# EasyEDA Pro project motor_driver.eprj

# Schematic Schematic1

## Sheets
1 P1: Create Date: 2024-08-04; Page Name: P1; Project Name: motor_driver; Schematic Name: Schematic1; Update Date: 2024-08-04; Company: 嘉立创EDA; Page Size: A4; Version: V1.0
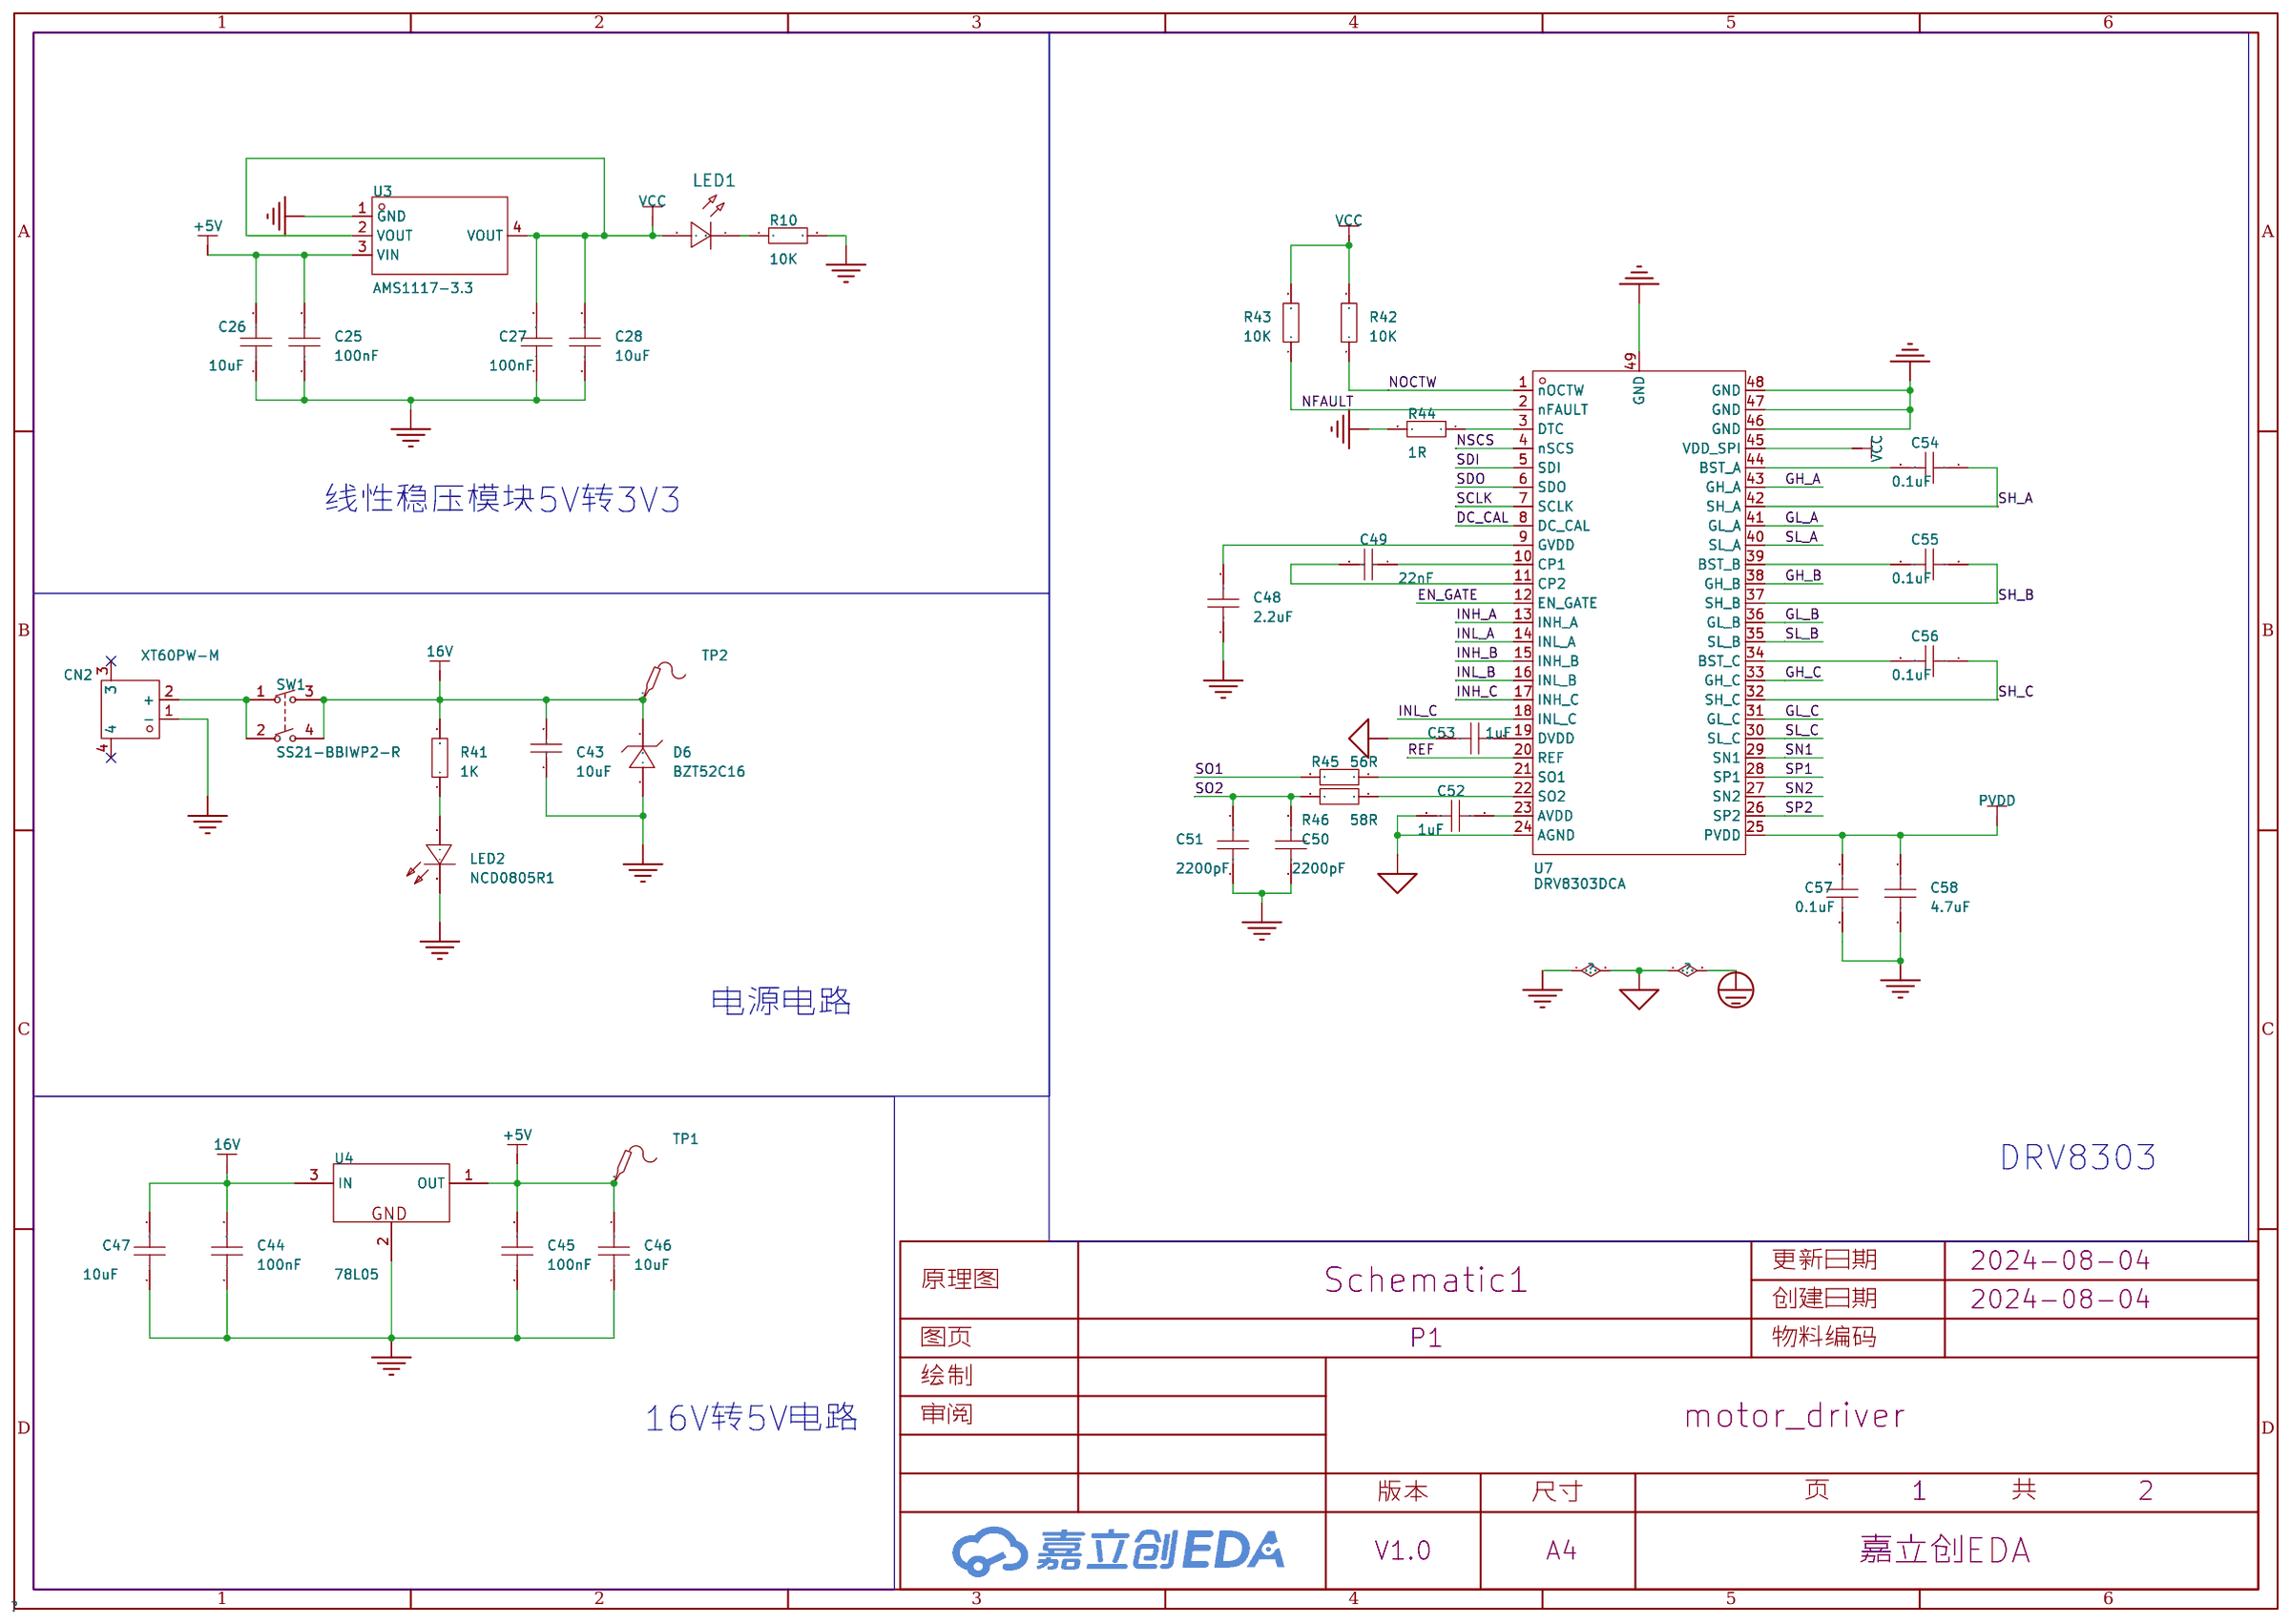
[diagram p0: P1]
2 P2: Page Name: P2
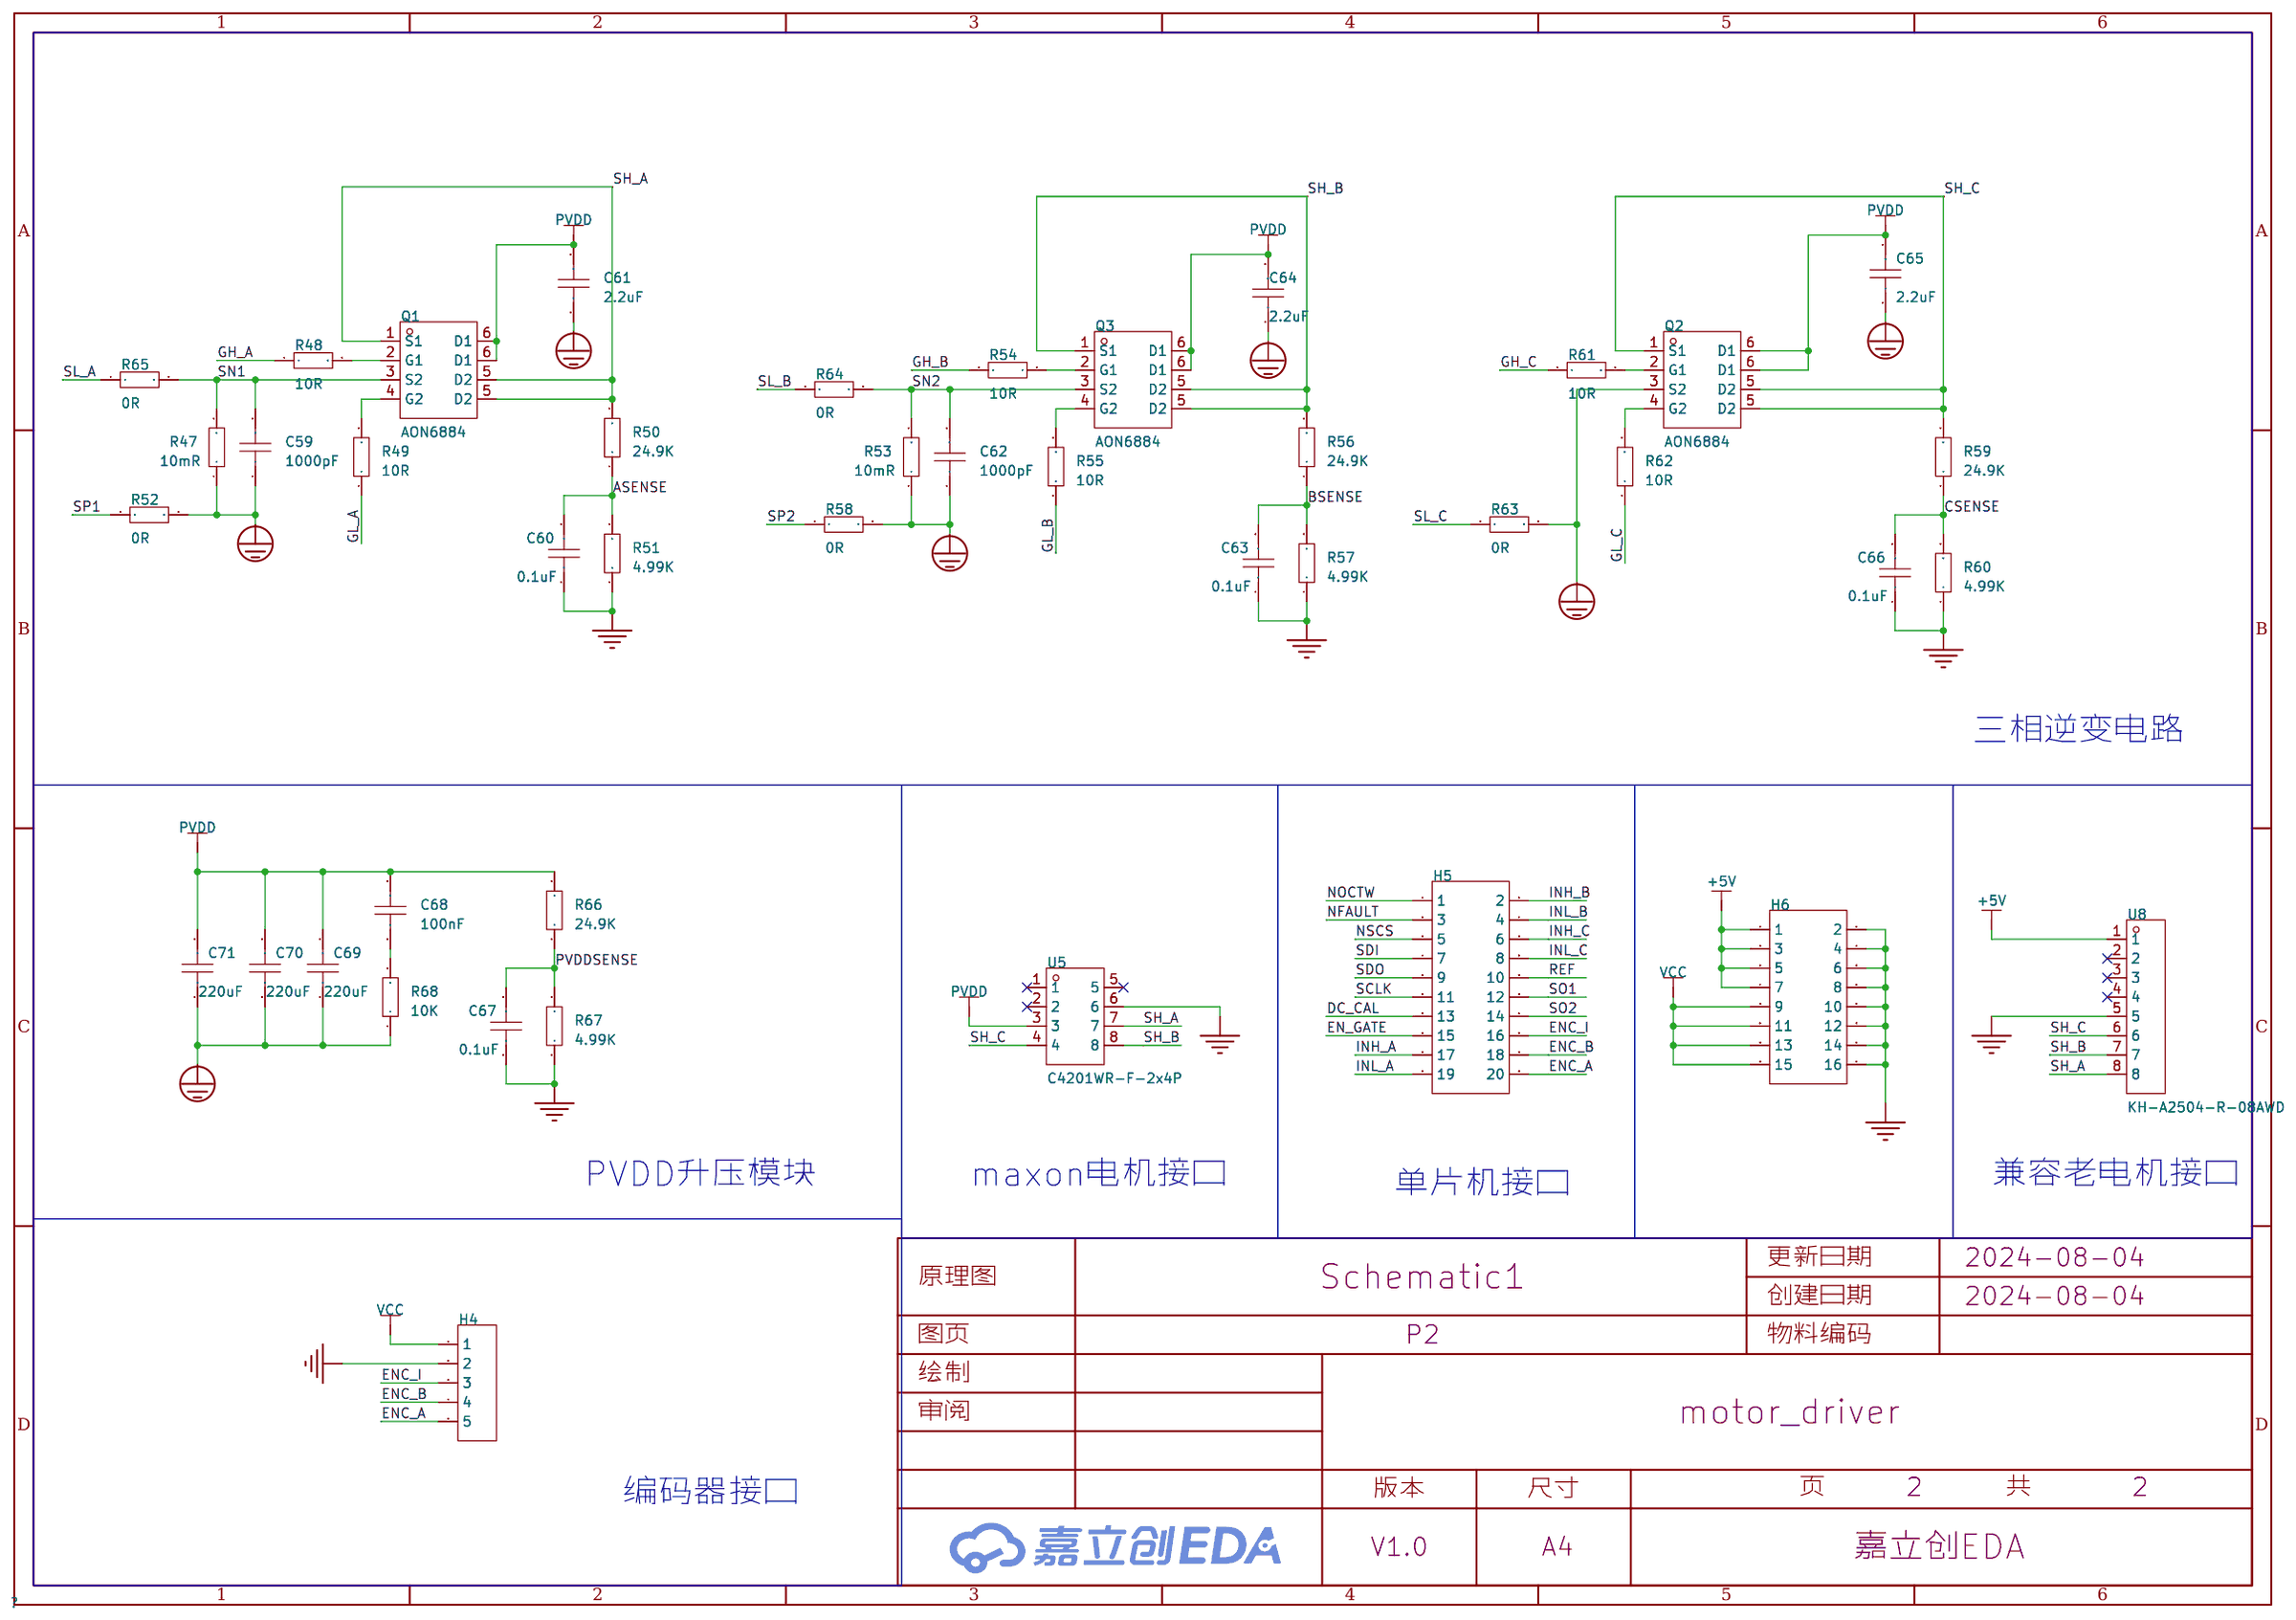
[diagram p1: P2]

## Parts
sheet P1
C25  100nF  [C0805]
C26  10uF  [C0805]
C27  100nF  [C0805]
C28  10uF  [C0805]
C43  10uF  [C1206]
C44  100nF  [C0805]
C45  100nF  [C0805]
C46  10uF  [C0805]
C47  10uF  [C0805]
C48  2.2uF  [C0805]
C49  22nF  [C0603]
C50  2200pF  [C0805]
C51  2200pF  [C0805]
C52  1uF  [C0805]
C53  1uF  [C0805]
C54  0.1uF  [C0805]
C55  0.1uF  [C0805]
C56  0.1uF  [C0805]
C57  0.1uF  [C0805]
C58  4.7uF  [C0805]
CN2  XT60PW-M  [CONN-TH_XT60PW-M]
D6  BZT52C16  [SOD-123_L2.7-W1.6-LS3.7-RD]
LED1  -  [LED_0805]
LED2  NCD0805R1  [LED0805-R-RD]
R10  10K  [R0805]
R41  1K  [R0603]
R42  10K  [R0603]
R43  10K  [R0603]
R44  1R  [R0603]
R45  56R  [R0603]
R46  58R  [R0603]
SW1  SS21-BBIWP2-R  [SW-TH_SS21-BBIWP2]
TP1  -  [Test-Point-0.5mm]
TP2  -  [Test-Point-0.5mm]
U3  AMS1117-3.3  [SOT-223-3_L6.5-W3.4-P2.30-LS7.0-BR]
U4  78L05  [SOT-89-3_L4.5-W2.5-P1.50-LS4.2-BR]
U7  DRV8303DCA  [HTSSOP-48_L12.5-W6.1-P0.50-LS8.1-BL-EP4.4]
sheet P2
C59  1000pF  [C0805]
C60  0.1uF  [C0603]
C61  2.2uF  [C0805]
C62  1000pF  [C0805]
C63  0.1uF  [C0603]
C64  2.2uF  [C0805]
C65  2.2uF  [C0805]
C66  0.1uF  [C0603]
C67  0.1uF  [C0603]
C68  100nF  [C0805]
C69  220uF  [C0805]
C70  220uF  [C0805]
C71  220uF  [C0805]
H4  -  [HDR-TH_5P-P2.54-V-F]
H5  -  [HDR-TH_20P-P2.54-V-R2-C10-S2.54]
H6  -  [HDR-TH_16P-P2.54-V-F-R2-C8-S2.54-1]
Q1  AON6884  [DFN-8_L5.5-W5.2-P1.27-LS6.0-BL-EP2]
Q2  AON6884  [DFN-8_L5.5-W5.2-P1.27-LS6.0-BL-EP2]
Q3  AON6884  [DFN-8_L5.5-W5.2-P1.27-LS6.0-BL-EP2]
R47  10mR  [R0603]
R48  10R  [R0603]
R49  10R  [R0603]
R50  24.9K  [R0603]
R51  4.99K  [R0603]
R52  0R  [R0603]
R53  10mR  [R0603]
R54  10R  [R0603]
R55  10R  [R0603]
R56  24.9K  [R0603]
R57  4.99K  [R0603]
R58  0R  [R0603]
R59  24.9K  [R0603]
R60  4.99K  [R0603]
R61  10R  [R0603]
R62  10R  [R0603]
R63  0R  [R0603]
R64  0R  [R0603]
R65  0R  [R0603]
R66  24.9K  [R0603]
R67  4.99K  [R0603]
R68  10K  [R0603]
U5  C4201WR-F-2x4P  [CONN-TH_C4201WR-F-2X4P]
U8  KH-A2504-R-08AWD  [CONN-TH_8P-P2.50_KH-A2504-R-08AWD]

## Library data of the parts
C25-C28 C44-C48 C50-C59 C61 C62 C64 C65 C68-C71 = CAP_0805: Supplier Footprint: 0805
C43 = CL31A106KBHNNNE: 容值:10uF;精度:±10%;额定电压:50V;材质(温度系数):X5R;; LCSC Part Name: 10uF ±10% 50V; Supplier Part: C13585; Manufacturer: SAMSUNG(三星); Supplier Footprint: 1206; JLCPCB Part Class: 基础库; Datasheet: https://atta.szlcsc.com/upload/public/pdf/source/20160218/1457707763339.pdf; Supplier: LCSC; Tolerance: ±10%; Voltage Rated: 50V; Temperature Coefficient: X5R
C49 = CL10B223KB8NNNC: 容值:22nF;精度:±10%;额定电压:50V;材质(温度系数):X7R;; LCSC Part Name: 22nF ±10% 50V; Supplier Part: C21122; Manufacturer: SAMSUNG(三星); Supplier Footprint: 0603; JLCPCB Part Class: 基础库; Datasheet: https://atta.szlcsc.com/upload/public/pdf/source/20160218/1457707763339.pdf; Supplier: LCSC; Tolerance: ±10%; Voltage Rated: 50V; Temperature Coefficient: X7R
CN2 = XT60PW-M: 类别:-;类型1:-;; LCSC Part Name: AMASS(艾迈斯)航模插头xt60连接器150公母对接pw锂电池公头 板插卧式XT60PW-M; Supplier Part: C98732; Manufacturer: AMASS(艾迈斯); JLCPCB Part Class: 扩展库; Datasheet: https://atta.szlcsc.com/upload/public/pdf/source/20240118/44A3DCFF53BE25DC65378AFFB21277A4.pdf; Supplier: LCSC; Brand: 艾迈斯; Type: 卧式插头; Colour: 黄色; InterfaceType: 公头
D6 = BZT52C16_C216724: 二极管配置:独立式;稳压值(标称值):16V;稳压值(范围):15.3V~17.1V;功率:500mW;精度:±5%;; Supplier Part: C216724; Manufacturer: SHIKUES(时科); Supplier Footprint: SOD-123; JLCPCB Part Class: 扩展库; Datasheet: https://atta.szlcsc.com/upload/public/pdf/source/20180521/C216736_0F7817A5B0D519AB82EE72E876335F07.pdf; Supplier: LCSC; Diode Configuration: 独立式; Zener Voltage (Nom): 16V; Reverse Leakage Current (Ir): 100nA@12V; Zener Voltage (Range): 15.3V~17.1V; Power Dissipation: 500mW; Zener Impedance (Zzt): 40Ω; Tolerance: ±5%
LED1 = LED_0805-R: Supplier Footprint: 0805
LED2 = NCD0805R1: 灯头类型:-;发光颜色:红色;正向电压(VF):1.6V~2.6V;功率:65mW;正向电流:20mA;主波长:615nm~630nm;二极管配置:独立二极管;透镜颜色:无色透明透镜;色温:-;发光强度:67mcd~195mcd;发光角度:130°;载带方式:-;工作温度:-30℃~+85℃;; Supplier Part: C84256; Manufacturer: 国星光电; Supplier Footprint: 0805; JLCPCB Part Class: 基础库; Datasheet: https://atta.szlcsc.com/upload/public/pdf/source/20200820/C84256_F0A75A43B3EAD75808600A0514C76B99.pdf; Supplier: LCSC; Emitted Color: 红色; Forward Voltage (VF): 1.6V~2.6V; Power Dissipation: 65mW; Forward Current: 20mA; Dominant Wavelength: 615nm~630nm; Diode Configuration: 独立二极管; Lens Color: 无色透明透镜; Luminous Intensity: 67mcd~195mcd; Viewing Angle: 130°; Operating Temperature: -30℃~+85℃
R10 = Res_0805: Supplier Footprint: 0805
R41-R68 = Res_0603: Supplier Footprint: 0603
SW1 = SS21-BBIWP2-R: 带灯:-;引脚样式:焊片;额定电流:10A;额定电压(AC):250V;额定电压(DC):-;电路结构:双刀单掷;机械寿命:-;; LCSC Part Name: 跷板开关DPST 15x21mm; Supplier Part: C309182; Manufacturer: Legion(六钧); Supplier Footprint: 插件; JLCPCB Part Class: 扩展库; Datasheet: https://atta.szlcsc.com/upload/public/pdf/source/20190311/C309182_BE3155CDE2291F8D537E9264D9294CC5.pdf; Supplier: LCSC; Actuator Type: 凹面弯曲; Pin Style: 焊片; Actuator Color: 黑色; Contact Current: 10A; Voltage Rating (AC): 250V; Circuit: 双刀单掷; Actuator Identifier: - O
TP1 TP2 = Test-Point: Test Point 测试点
U3 = AMS1117-3.3_C6186: 输出类型:固定;最大输入电压:-;输出电压:3.3V;最大输出电流:1A;电源纹波抑制比(PSRR):72dB@(120Hz);输出极性:正极;; LCSC Part Name: 输出3.3V 1A; Supplier Part: C6186; Manufacturer: AMS; Supplier Footprint: SOT-223; JLCPCB Part Class: 基础库; Datasheet: https://atta.szlcsc.com/upload/public/pdf/source/20180727/C6186_7A095716F0823C02F1997A905E26C086.pdf; Supplier: LCSC; Output Type: 固定; Output Voltage: 3.3V; MAX Output Current: 1A; Power Supply Rejection Ratio (PSRR): 72dB@(120Hz); Dropout Voltage: 1.3V@(800mA); Output Polarity: 正极; Number of Outputs: 1
U4 = 78L05_C347258: 输出类型:固定;最大输入电压:30V;输出电压:5V;最大输出电流:100mA;电源纹波抑制比(PSRR):49dB@(120Hz);输出极性:正极;; LCSC Part Name: 输入30V 输出5V 100mA; Supplier Part: C347258; Manufacturer: UMW(友台半导体); Supplier Footprint: SOT-89-3; JLCPCB Part Class: 扩展库; Datasheet: https://atta.szlcsc.com/upload/public/pdf/source/20231109/E3DE607B64FB2BED1580456949804217.pdf; Supplier: LCSC; Output Type: 固定; Maximum Input Voltage: 30V; Output Voltage: 5V; MAX Output Current: 100mA; Power Supply Rejection Ratio (PSRR): 49dB@(120Hz); Dropout Voltage: 1.7V@(40mA); standby current: 5.5mA; Operating Temperature: -20℃~+120℃@(Tj); Output Polarity: 正极; Number of Outputs: 1
U7 = DRV8303DCA: DRV8303 具有电流分流放大器和 SPI 的最大 65V 三相栅极驱动器; LCSC Part Name: 无刷直流BLDC电机驱动芯片 60V; Supplier Part: C1523892; Manufacturer: TI(德州仪器); Supplier Footprint: HTSSOP-48-EP-6.1mm; JLCPCB Part Class: 扩展库; Datasheet: https://www.ti.com/cn/lit/gpn/drv8303; Supplier: LCSC
C60 C63 C66 C67 = CAP_0603: Supplier Footprint: 0603
H4 = HDR-F_2.54_1x5P: Supplier Part: C50950; Supplier Footprint: 插件
H5 = HDR-F_2.54_2x10: Supplier Part: C30867; Supplier Footprint: 插件
H6 = HDR-F_2.54_2x8: Supplier Part: C30734; Supplier Footprint: 插件
Q1-Q3 = AON6884: 类型:2个N沟道;漏源电压(Vdss):40V;连续漏极电流(Id):9A;功率(Pd):1.6W;导通电阻(RDS(on)@Vgs,Id):11.3mΩ@10V,10A;阈值电压(Vgs(th)@Id):2.7V@250uA;; LCSC Part Name: 2个N沟道 耐压:40V 电流:9A; Supplier Part: C125872; Manufacturer: AOS; Supplier Footprint: DFN-8(5.2x5.5); JLCPCB Part Class: 扩展库; Datasheet: https://atta.szlcsc.com/upload/public/pdf/source/20180326/C125872_34AF0DD57D8DED273B86A053347F87CE.pdf; Supplier: LCSC; Type: 2个N沟道; Drain Source Voltage (Vdss): 40V; Continuous Drain Current (Id): 9A; Power Dissipation (Pd): 1.6W; Drain Source On Resistance (RDS(on)@Vgs,Id): 11.3mΩ@10V,10A; Gate Threshold Voltage (Vgs(th)@Id): 2.7V@250uA
U5 = C4201WR-F-2x4P_C5333426: Supplier Part: C5333426; Manufacturer: CJT(长江连接器); Supplier Footprint: 弯插,P=4.2mm; JLCPCB Part Class: 扩展库; Datasheet: https://atta.szlcsc.com/upload/public/pdf/source/20210326/C2764355_A41BE8F3AF9C3DD861E3A84F228C93DC.pdf; Supplier: LCSC
U8 = KH-A2504-R-08AWD: 插针结构:1x8P;间距:2.54mm;安装方式:弯插;总PIN数:8P;排数:1;每排PIN数:8;; LCSC Part Name: 间距:2.54mm 1x8P 白色; Supplier Part: C18186422; Manufacturer: kinghelm(金航标); Supplier Footprint: 插件,P=2.5mm; JLCPCB Part Class: 扩展库; Datasheet: https://atta.szlcsc.com/upload/public/pdf/source/20230919/6D15C2409625FC46455D302EA5C53430.pdf; Supplier: LCSC; Pins Structure: 1x8P; Pitch: 2.54mm; Mounting Style: 弯插; Number of Pins: 8P; Number of Rows: 1; Number of PINs Per Row: 8

## Nets
16V: C43.2 C44.2 C47.2 D6.1(K) R41.2 SW1.3 SW1.4 TP2.1 U4.3(IN)
+5V: C25.2 C26.2 C45.2 C46.2 H6.1 H6.3 H6.5 H6.7 TP1.1 U3.3(VIN) U4.1(OUT) U8.1
AGND: C25.1 C26.1 C27.1 C28.1 C43.1 C44.1 C45.1 C46.1 C47.1 C48.1 C50.1 C51.1 C52.2 C53.2 C57.2 C58.2 C59.1 C60.1 C61.1 C62.1 C63.1 C64.1 C65.1 C66.1 C67.1 C69.1 C70.1 C71.1 CN2.1(-) D6.2(A) H4.2 H6.2 H6.4 H6.6 H6.8 H6.10 H6.12 H6.14 H6.16 LED2.2(-) Q2.3(S2) R10.2 R44.2 R47.1 R51.1 R52.2 R53.1 R57.1 R58.2 R60.1 R63.2 R67.1 R68.1 U3.1(GND) U4.2(GND) U5.6 U7.24(AGND) U7.46(GND) U7.47(GND) U7.48(GND) U7.49(GND) U8.5
PVDD: C57.1 C58.1 C61.2 C64.2 C65.2 C68.2 C69.2 C70.2 C71.2 Q1.6(D1) Q2.6(D1) Q3.6(D1) R66.2 U5.3 U7.25(PVDD)
PVDDSENSE: C67.2 R66.1 R67.2
VCC: C27.2 C28.2 H4.1 H6.9 H6.11 H6.13 H6.15 LED1.2(A) R42.2 R43.2 U3.2(VOUT) U3.4(VOUT) U7.45(VDD_SPI)
ASENSE: C60.2 R50.1 R51.2
BSENSE: C63.2 R56.1 R57.2
CSENSE: C66.2 R59.1 R60.2
DC_CAL: H5.13 U7.8(DC_CAL)
EN_GATE: H5.15 U7.12(EN_GATE)
ENC_A: H4.5 H5.20
ENC_B: H4.4 H5.18
ENC_I: H4.3 H5.16
GH_A: R48.1 U7.43(GH_A)
GH_B: R54.1 U7.38(GH_B)
GH_C: R61.1 U7.33(GH_C)
GL_A: R49.1 U7.41(GL_A)
GL_B: R55.1 U7.36(GL_B)
GL_C: R62.1 U7.31(GL_C)
INH_A: H5.17 U7.13(INH_A)
INH_B: H5.2 U7.15(INH_B)
INH_C: H5.6 U7.17(INH_C)
INL_A: H5.19 U7.14(INL_A)
INL_B: H5.4 U7.16(INL_B)
INL_C: H5.8 U7.18(INL_C)
NFAULT: H5.3 R43.1 U7.2(nFAULT)
NOCTW: H5.1 R42.1 U7.1(nOCTW)
NSCS: H5.5 U7.4(nSCS)
REF: H5.10 U7.20(REF)
SCLK: H5.11 U7.7(SCLK)
SDI: H5.7 U7.5(SDI)
SDO: H5.9 U7.6(SDO)
SH_A: C54.1 Q1.1(S1) Q1.5(D2) R50.2 U5.7 U7.42(SH_A) U8.8
SH_B: C55.1 Q3.1(S1) Q3.5(D2) R56.2 U5.8 U7.37(SH_B) U8.7
SH_C: C56.1 Q2.1(S1) Q2.5(D2) R59.2 U5.4 U7.32(SH_C) U8.6
SL_A: R65.1 U7.40(SL_A)
SL_B: R64.1 U7.35(SL_B)
SL_C: R63.1 U7.30(SL_C)
SN1: C59.2 Q1.3(S2) R47.2 R65.2 U7.29(SN1)
SN2: C62.2 Q3.3(S2) R53.2 R64.2 U7.27(SN2)
SO1: H5.12 R45.2
SO2: C50.2 C51.2 H5.14 R46.2
SP1: R52.1 U7.28(SP1)
SP2: R58.1 U7.26(SP2)
$3N286: LED1.1(C) R10.1
$3N603: CN2.2(+) SW1.1 SW1.2
$3N605: LED2.1(+) R41.1
$3N1469: R44.1 U7.3(DTC)
$3N1546: C48.2 U7.9(GVDD)
$3N1634: C49.1 U7.10(CP1)
$3N1637: C49.2 U7.11(CP2)
$3N1642: R45.1 U7.21(SO1)
$3N1645: R46.1 U7.22(SO2)
$3N1837: C52.1 U7.23(AVDD)
$3N1907: C53.1 U7.19(DVDD)
$3N2117: C54.2 U7.44(BST_A)
$3N2227: C56.2 U7.34(BST_C)
$3N2233: C55.2 U7.39(BST_B)
$4N615: Q1.2(G1) R48.2
$4N618: Q1.4(G2) R49.2
$4N1413: Q3.2(G1) R54.2
$4N1415: Q3.4(G2) R55.2
$4N1749: Q2.2(G1) R61.2
$4N1755: Q2.4(G2) R62.2
$4N2179: C68.1 R68.2

Not connected (* = marked no-connect by the designer): CN2 3* 4*; U5 1* 2* 5*; U8 2* 3* 4*

## Notes on the sheets
sheet 1
- 线性稳压模块5V转3V3
- 电源电路
- DRV8303
- 16V转5V电路
sheet 2
- 三相逆变电路
- PVDD升压模块
- maxon电机接口
- 单片机接口
- 兼容老电机接口
- 编码器接口

# Board PCB1
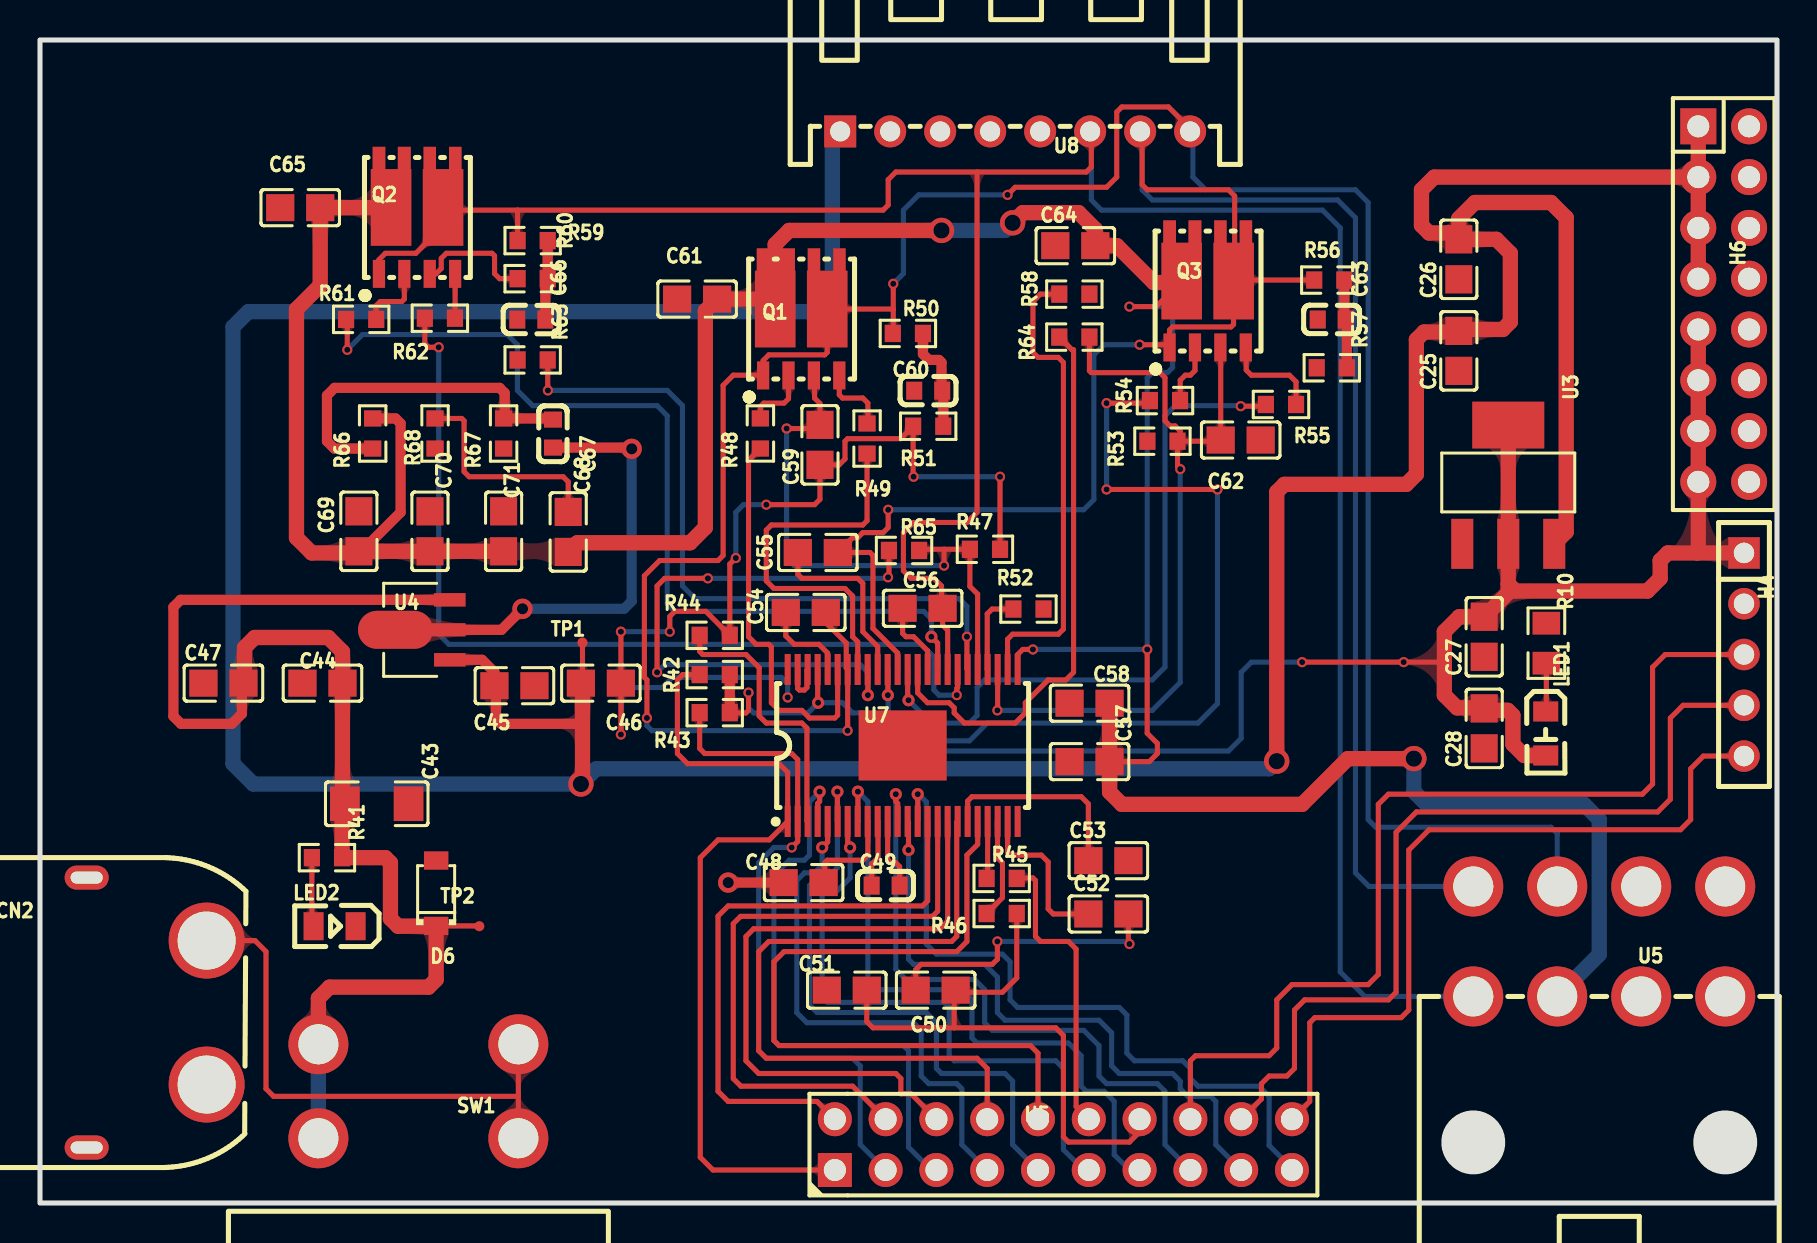
[diagram p2: board, top side]
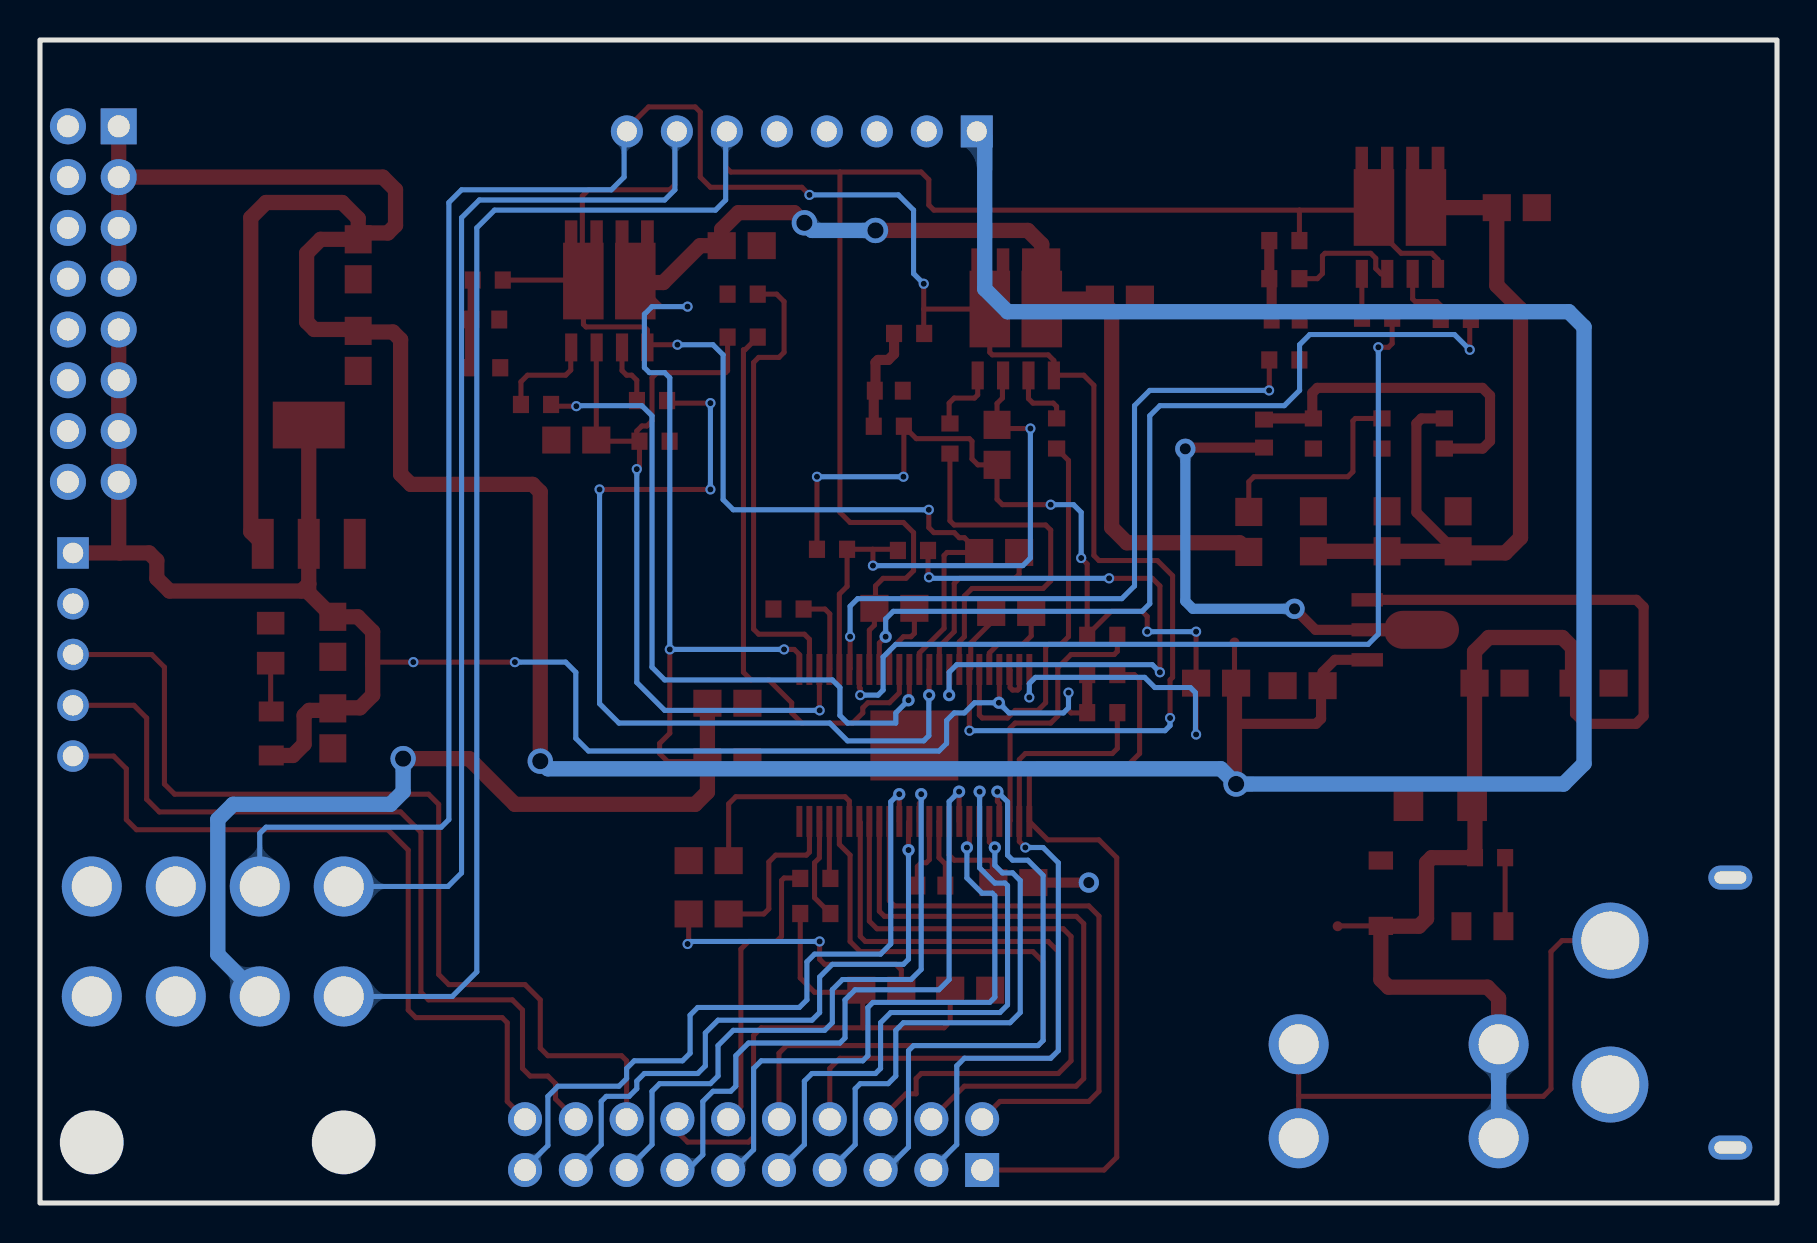
[diagram p3: board, bottom side, seen from below]

Outline 86.87 x 58.17 mm; copper layers: Top Layer, Bottom Layer. Coordinates in mm from the lower left corner of the outline.
Outline path: rectangle 0,58.17 86.87,0
Stack: Top Layer 0.035mm / Dielectric1 1.51mm FR4 er 4.5 / Bottom Layer 0.035mm

## Design rules (mm)
template: JLCPCB Capability(Two Layers Board)
spacing copperThickness1oz (default): track to track 0.102, other pairs 0.152 to 0.3
spacing copperThickness2oz: track to track 0.203, other pairs 0.152 to 0.3
track width copperThickness1oz (default): min 0.127, default 0.254, max 2.54
track width copperThickness2oz: min 0.203, default 0.254, max 2.54
differential pair differentialPair (default): width min 0.127, default 0.254, max 2.54; gap min 0.152, default 0.152
via viaSize (default): diameter min 0.5, default 0.61, max 10; hole min 0.3, default 0.305, max 6.3

## Placement (name value [footprint] x y rotation side)
C25  100nF  [C0805]  70.95 42.62 90 top
C26  10uF  [C0805]  70.95 47.2 90 top
C27  100nF  [C0805]  72.22 28.32 90 top
C28  10uF  [C0805]  72.22 23.74 90 top
C43  10uF  [C1206]  16.84 19.97 180 top
C44  100nF  [C0805]  14.13 26 0 top
C45  100nF  [C0805]  23.73 25.87 180 top
C46  10uF  [C0805]  28.05 26 180 top
C47  10uF  [C0805]  9.17 26 0 top
C48  2.2uF  [C0805]  38.19 16.03 0 top
C49  22nF  [C0603]  42.29 15.88 0 top
C50  2200pF  [C0805]  44.79 10.65 0 top
C51  2200pF  [C0805]  40.35 10.65 0 top
C52  1uF  [C0805]  53.43 14.46 0 top
C53  1uF  [C0805]  53.43 17.12 0 top
C54  0.1uF  [C0805]  38.3 29.53 180 top
C55  0.1uF  [C0805]  38.9 32.54 180 top
C56  0.1uF  [C0805]  44.14 29.74 180 top
C57  0.1uF  [C0805]  52.49 22.08 180 top
C58  4.7uF  [C0805]  52.49 25 180 top
C59  1000pF  [C0805]  39.01 37.92 90 top
C60  0.1uF  [C0603]  44.42 40.63 0 top
C61  2.2uF  [C0805]  32.86 45.21 0 top
C62  1000pF  [C0805]  60.05 38.16 180 top
C63  0.1uF  [C0603]  64.6 44.19 0 top
C64  2.2uF  [C0805]  51.78 47.88 0 top
C65  2.2uF  [C0805]  13.01 49.78 0 top
C66  0.1uF  [C0603]  24.57 44.18 0 top
C67  0.1uF  [C0603]  25.65 38.48 90 top
C68  100nF  [C0805]  26.42 33.56 270 top
C69  220uF  [C0805]  15.95 33.59 270 top
C70  220uF  [C0805]  19.5 33.59 270 top
C71  220uF  [C0805]  23.19 33.59 270 top
CN2  XT60PW-M  [CONN-TH_XT60PW-M]  5.33 9.53 0 top
D6  BZT52C16  [SOD-123_L2.7-W1.6-LS3.7-RD]  19.81 15.49 90 top
H4  -  [HDR-TH_5P-P2.54-V-F]  85.22 27.43 270 top
H5  -  [HDR-TH_20P-P2.54-V-R2-C10-S2.54]  51.18 2.92 0 top
H6  -  [HDR-TH_16P-P2.54-V-F-R2-C8-S2.54-1]  84.2 44.96 270 top
LED1  -  [LED_0805]  75.3 23.43 270 top
LED2  NCD0805R1  [LED0805-R-RD]  14.73 13.84 180 top
Q1  AON6884  [DFN-8_L5.5-W5.2-P1.27-LS6.0-BL-EP2]  38.07 43.05 0 top
Q2  AON6884  [DFN-8_L5.5-W5.2-P1.27-LS6.0-BL-EP2]  18.86 48.13 0 top
Q3  AON6884  [DFN-8_L5.5-W5.2-P1.27-LS6.0-BL-EP2]  58.4 44.45 0 top
R10  10K  [R0805]  75.33 28 90 top
R41  1K  [R0603]  14.35 17.27 0 top
R42  10K  [R0603]  33.74 26.43 0 top
R43  10K  [R0603]  33.74 24.52 0 top
R44  1R  [R0603]  33.74 28.39 0 top
R45  56R  [R0603]  48.09 16.23 0 top
R46  58R  [R0603]  48.09 14.48 0 top
R47  10mR  [R0603]  47.26 32.69 180 top
R48  10R  [R0603]  36.03 38.49 90 top
R49  10R  [R0603]  41.36 38.23 90 top
R50  24.9K  [R0603]  43.4 43.49 180 top
R51  4.99K  [R0603]  44.42 38.85 0 top
R52  0R  [R0603]  49.43 29.71 0 top
R53  10mR  [R0603]  56.13 38.1 0 top
R54  10R  [R0603]  56.26 40.13 0 top
R55  10R  [R0603]  62.06 39.94 0 top
R56  24.9K  [R0603]  64.48 46.16 180 top
R57  4.99K  [R0603]  64.6 41.77 0 top
R58  0R  [R0603]  51.73 45.46 0 top
R59  24.9K  [R0603]  24.64 48.13 180 top
R60  4.99K  [R0603]  24.64 46.23 0 top
R61  10R  [R0603]  16.06 44.19 0 top
R62  10R  [R0603]  20 44.25 0 top
R63  0R  [R0603]  24.64 42.16 180 top
R64  0R  [R0603]  51.73 43.31 0 top
R65  0R  [R0603]  43.21 32.64 0 top
R66  24.9K  [R0603]  16.64 38.49 90 top
R67  4.99K  [R0603]  23.19 38.49 90 top
R68  10K  [R0603]  19.76 38.49 90 top
SW1  SS21-BBIWP2-R  [SW-TH_SS21-BBIWP2]  18.92 5.59 180 top
TP1  -  [Test-Point-0.5mm]  27.13 28.03 0 top
TP2  -  [Test-Point-0.5mm]  21.97 13.84 0 top
U3  AMS1117-3.3  [SOT-223-3_L6.5-W3.4-P2.30-LS7.0-BR]  73.43 35.94 270 top
U4  78L05  [SOT-89-3_L4.5-W2.5-P1.50-LS4.2-BR]  19.14 28.67 0 top
U5  C4201WR-F-2x4P  [CONN-TH_C4201WR-F-2X4P]  77.98 13.08 180 top
U7  DRV8303DCA  [HTSSOP-48_L12.5-W6.1-P0.50-LS8.1-BL-EP4.4]  43.14 22.88 0 top
U8  KH-A2504-R-08AWD  [CONN-TH_8P-P2.50_KH-A2504-R-08AWD]  48.77 53.59 180 top

## Footprints (pads in the part's own frame, mm; a bottom-side part is the same pattern mirrored in y, then rotated)
C0603
  rect 0.8x0.9 smd: 1(-0.7,0) 2(0.7,0)
C0805
  rect 1.41x1.35 smd: 1(-1,0) 2(1,0)
C1206
  rect 1.485x1.728 smd: 1(-1.593,0) 2(1.593,0)
CONN-TH_8P-P2.50_KH-A2504-R-08AWD
  rect 1.6x1.6 hole 1: 1(8.75,0)
  round 1.6 hole 1: 2(6.25,0) 3(3.75,0) 4(1.25,0) 5(-1.25,0) 6(-3.75,0) 7(-6.25,0) 8(-8.75,0)
CONN-TH_C4201WR-F-2X4P
  round 3 hole 2: 1(-6.3,2.75) 2(-2.1,2.75) 3(2.1,2.75) 4(6.3,2.75) 5(-6.3,-2.75) 6(-2.1,-2.75) 7(2.1,-2.75) 8(6.3,-2.75)
CONN-TH_XT60PW-M
  round 3.8 hole 2.9: 1(3,-3.6) 2(3,3.6)
  oval 2.2x1.2 hole 1.6x0.6: 3(-3,6.75) 4(-3,-6.75)
DFN-8_L5.5-W5.2-P1.27-LS6.0-BL-EP2
  rect 0.61x1.397 smd: 1(-1.905,-1.66) 2(-0.635,-1.66) 3(0.635,-1.66) 4(1.905,-1.66)
  custom 2.028x4.953 smd: 5(1.3,1.66) 6(-1.3,1.66)
HDR-TH_5P-P2.54-V-F
  rect 1.575x1.575 hole 1.02: 1(-5.08,0)
  round 1.575 hole 1.02: 2(-2.54,0) 3(0,0) 4(2.54,0) 5(5.08,0)
HDR-TH_16P-P2.54-V-F-R2-C8-S2.54-1
  rect 1.8x1.8 hole 1.1: 1(-8.89,-1.27)
  round 1.8 hole 1.1: 2(-8.89,1.27) 3(-6.35,-1.27) 4(-6.35,1.27) 5(-3.81,-1.27) 6(-3.81,1.27) 7(-1.27,-1.27) 8(-1.27,1.27) 9(1.27,-1.27) 10(1.27,1.27) 11(3.81,-1.27) 12(3.81,1.27) 13(6.35,-1.27) 14(6.35,1.27) 15(8.89,-1.27) 16(8.89,1.27)
HDR-TH_20P-P2.54-V-R2-C10-S2.54
  rect 1.7x1.7 hole 1.1: 1(-11.43,-1.27)
  round 1.7 hole 1.1: 2(-11.43,1.27) 3(-8.89,-1.27) 4(-8.89,1.27) 5(-6.35,-1.27) 6(-6.35,1.27) 7(-3.81,-1.27) 8(-3.81,1.27) 9(-1.27,-1.27) 10(-1.27,1.27) 11(1.27,-1.27) 12(1.27,1.27) 13(3.81,-1.27) 14(3.81,1.27) 15(6.35,-1.27) 16(6.35,1.27) 17(8.89,-1.27) 18(8.89,1.27) 19(11.43,-1.27) 20(11.43,1.27)
HTSSOP-48_L12.5-W6.1-P0.50-LS8.1-BL-EP4.4
  rect 0.3x1.55 smd: 1(-5.75,-3.8) 2(-5.25,-3.8) 3(-4.75,-3.8) 4(-4.25,-3.8) 5(-3.75,-3.8) 6(-3.25,-3.8) 7(-2.75,-3.8) 8(-2.25,-3.8) 9(-1.75,-3.8) 10(-1.25,-3.8) 11(-0.75,-3.8) 12(-0.25,-3.8) 13(0.25,-3.8) 14(0.75,-3.8) 15(1.25,-3.8) 16(1.75,-3.8) 17(2.25,-3.8) 18(2.75,-3.8) 19(3.25,-3.8) 20(3.75,-3.8) 21(4.25,-3.8) 22(4.75,-3.8) 23(5.25,-3.8) 24(5.75,-3.8) 25(5.75,3.8) 26(5.25,3.8) 27(4.75,3.8) 28(4.25,3.8) 29(3.75,3.8) 30(3.25,3.8) 31(2.75,3.8) 32(2.25,3.8) 33(1.75,3.8) 34(1.25,3.8) 35(0.75,3.8) 36(0.25,3.8) 37(-0.25,3.8) 38(-0.75,3.8) 39(-1.25,3.8) 40(-1.75,3.8) 41(-2.25,3.8) 42(-2.75,3.8) 43(-3.25,3.8) 44(-3.75,3.8) 45(-4.25,3.8) 46(-4.75,3.8) 47(-5.25,3.8) 48(-5.75,3.8)
  rect 4.4x3.5 smd: 49(0,0)
LED0805-R-RD
  rect 1x1.399 smd: 1(1.05,0) 2(-1.05,0)
LED_0805
  rect 1x1.25 smd: 1(-1.15,0.005) 2(1.05,0.005)
R0603
  rect 0.806x0.864 smd: 1(-0.753,0) 2(0.753,0)
R0805
  rect 1.133x1.377 smd: 1(-1,0) 2(1,0)
SOD-123_L2.7-W1.6-LS3.7-RD
  rect 0.91x1.22 smd: 1(-1.635,0) 2(1.635,0)
SOT-89-3_L4.5-W2.5-P1.50-LS4.2-BR
  rect 1.575x0.672 smd: 1(1.356,-1.5) 3(1.356,1.5)
  custom 5.377x1.9 smd: 2(-1.356,0)
SOT-223-3_L6.5-W3.4-P2.30-LS7.0-BR
  rect 2.5x1.1 smd: 1(2.97,-2.3) 2(2.97,0) 3(2.97,2.3)
  rect 2.34x3.6 smd: 4(-2.97,0)
SW-TH_SS21-BBIWP2
  round 3 hole 2: 1(-5,2.35) 2(-5,-2.35) 3(5,2.35) 4(5,-2.35)
Test-Point-0.5mm
  round 0.5 smd: 1(0,0)

## Nets
As in the schematic.

Pads without a net: CN2 3 4; U5 1 2 5; U8 2 3 4

## Via types
v1: diameter 0.508, hole 0.305, Top Layer to Bottom Layer, 39 vias
v2: diameter 0.61, hole 0.305, Top Layer to Bottom Layer, 13 vias
v3: diameter 1.016, hole 0.559, Top Layer to Bottom Layer, 3 vias
v4: diameter 1.27, hole 0.813, Top Layer to Bottom Layer, 5 vias

## Routing (per net, layer and track width the routed paths; a pad name or vN(x,y) marks a point on that pad's centre or on a via; arc(x,y) is an arc through that point)
16V: length 68.3
  Top Layer w0.254: D6.1 21.95,13.86 TP2.1
  Top Layer w0.508: U4.3 7.03,30.17 6.67,29.81 6.67,24.35 7.05,23.96 9.59,23.96 10.1,24.47 10.1,25.93 C47.2
  Top Layer w0.762: SW1.4 13.92,10.24 14.48,10.8 19.43,10.8 19.81,11.18 D6.1 19.8,13.84 17.91,13.84 17.53,14.22 17.53,17.02 17.27,17.27 R41.2 15.1,19.82 C43.2 15.13,20.09 C44.2 15.13,27.57 14.42,28.28 10.74,28.28 10.23,27.77 10.23,26.05 C47.2
  Bottom Layer w0.762: SW1.4 SW1.3
+5V: length 220.3
  Top Layer w0.254: TP1.1 27.13,26.08 C46.2
  Top Layer w0.508: U4.1 22.11,27.17 22.73,26.55 C45.2 22.8,25.8 22.8,24.22 23.05,23.96 27.05,23.96 C46.2
  Top Layer w0.762: C26.2 70.95,49.24 71.76,50.04 75.57,50.04 76.33,49.28 76.33,33.57 U3.3 ; C26.2 70.64,48.51 69.47,48.51 69.09,48.9 69.09,50.67 69.72,51.31 H6.3 ; C26.2 72.83,48.2 73.53,47.5 73.53,44.07 73.15,43.69 71.02,43.69 C25.2 70.9,43.56 69.21,43.56 68.83,43.18 68.83,36.45 68.33,35.94 62.23,35.94 61.85,35.56 v4(61.85,22.1) ; H6.7 H6.5 H6.3 ; H6.3 H6.1 ; v4(27.05,20.96) 27.13,21.03 27.13,26.08
  Bottom Layer w0.762: 39.88,53.59 39.62,53.34 39.62,45.72 38.48,44.58 10.41,44.58 9.65,43.82 9.65,21.97 10.67,20.96 v4(27.05,20.96) 27.81,21.72 61.47,21.72 v4(61.85,22.1)
AGND: length 102.2
  Top Layer w0.254: v1(36.32,34.93) 38.73,34.93 39.01,35.2 C59.1 39.97,36.92 40.26,37.21 40.26,38.1 40.39,38.23 43.04,38.23 R51.1 43.67,36.34 v1(43.69,36.32) ; v1(47.88,13.08) 47.88,12.19 47.63,11.94 44.07,11.94 43.79,11.66 C50.1 ; v1(54.48,12.95) 54.43,13.01 C52.2 ; U7.46 38.35,26.65 38.35,25.78 38.23,25.65 37.97,25.65 37.89,25.74 U7.47 ; v1(29.05,28.58) C46.1 v1(29.05,23.43) ; Q2.3 19.8,46.47 20.07,46.74 20.07,47.24 20.32,47.5 22.61,47.5 22.73,47.37 22.73,46.48 22.99,46.23 R60.1 ; R47.1 v1(48.01,36.32) ; v1(34.8,32.26) 34.5,31.96 R44.2 33.3,29.59 31.75,29.59 31.5,29.34 v1(31.5,28.58)
  Top Layer w0.508: v3(24.13,29.72) 23.08,28.67 U4.2 ; C67.1 29.53,37.78 v3(29.59,37.72) ; C48.1 v3(34.42,16.03)
  Bottom Layer w0.254: v1(47.88,13.08) 54.36,13.08 v1(54.48,12.95) ; v1(37.39,25.28) 37.39,25.98 37.08,26.29 31.62,26.29 31.11,25.78 29.34,25.78 29.08,25.53 29.08,23.46 v1(29.05,23.43) ; v1(34.8,32.26) 34.8,34.54 35.18,34.93 v1(36.32,34.93) ; v1(29.05,28.58) v1(31.5,28.58) ; v1(43.69,36.32) v1(48.01,36.32)
  Bottom Layer w0.508: v3(29.59,37.72) 29.59,30.1 29.21,29.72 v3(24.13,29.72)
PVDD: length 168.6
  Top Layer w0.254: 57.02,46.04 55.82,44.83 v1(54.48,44.83) ; C57.1 55.48,22.08 55.88,22.48 55.88,22.99 55.37,23.5 v1(55.37,27.69) ; v1(49.66,27.69) 49.15,27.69 48.89,27.43 U7.25
  Top Layer w0.508: R66.2 17.78,39.24 18.03,38.99 18.03,34.54 16.47,32.98 16.47,32.59
  Top Layer w0.762: Q2.6 17.55,49.78 C65.2 14.01,45.89 12.83,44.7 12.83,33.27 13.59,32.51 15.86,32.51 C69.2 C70.2 C71.2 ; v4(45.08,48.64) 37.46,48.64 36.77,47.94 Q1.6 36.27,45.21 C61.2 33.27,44.62 33.27,33.78 32.51,33.02 26.87,33.02 C68.2 ; v4(48.64,49.02) 49.15,49.53 51.94,49.53 52.78,48.7 C64.2 53.85,47.88 55.7,46.04 57.02,46.04 Q3.6 ; C58.1 C57.1 53.49,20.55 54.1,19.94 63.12,19.94 65.4,22.23 v4(68.71,22.23)
  Bottom Layer w0.254: v1(54.48,44.83) 56.26,44.83 56.64,44.45 56.64,41.78 56.39,41.53 55.63,41.53 55.37,41.28 v1(55.37,27.69) v1(49.66,27.69)
  Bottom Layer w0.762: U5.3 77.98,12.43 77.98,19.18 77.22,19.94 69.34,19.94 68.71,20.57 v4(68.71,22.23) ; v4(45.08,48.64) 48.26,48.64 v4(48.64,49.02)
PVDDSENSE: length 17.7
  Top Layer w0.508: C67.2 25.6,39.24 R67.2 23.24,39.29 23.24,40.51 22.99,40.77 14.73,40.77 14.35,40.39 14.35,38.1 14.72,37.73 R66.1
VCC: length 94
  Top Layer w0.254: v2(38.91,25.02) 38.89,25.04 U7.45 ; v1(63.12,27.05) v1(68.2,27.05) 70.17,27.05 70.23,26.99 ; R43.2 34.51,24.51 35.31,24.51 35.43,24.64 v1(35.43,25.53)
  Top Layer w0.508: R42.2 R43.2
  Top Layer w0.762: 82.87,32.51 82.93,32.57 H6.15 H6.13 H6.11 H6.9 ; 82.87,32.51 81.41,32.51 81.03,32.13 81.03,31.24 80.39,30.61 73.79,30.61 73.43,30.97 ; 82.87,32.51 H4.1 ; 73.43,30.97 73.43,30.52 C27.2 70.97,29.32 70.23,28.58 70.23,25.4 70.87,24.77 72.2,24.77 C28.2 72.32,24.64 73.41,24.64 73.66,24.38 73.66,22.95 74.22,22.38 LED1.2 ; 73.43,30.97 U3.2 U3.4
  Bottom Layer w0.254: v1(35.43,25.53) 35.43,24.77 35.69,24.51 38.41,24.51 v2(38.91,25.02) 40.13,25.02 40.64,24.51 41.15,24.51 41.53,24.13 41.53,22.99 41.91,22.61 59.44,22.61 60.07,23.24 60.07,26.54 60.58,27.05 v1(63.12,27.05)
ASENSE: length 5.4
  Top Layer w0.508: 45.17,38.85 45.17,40.57 C60.2 45.08,40.66 45.08,42.04 44.96,42.16 44.45,42.16 44.16,42.46 44.16,43.49
BSENSE: length 4.4
  Top Layer w0.508: R57.2 65.36,44.13 C63.2 65.23,44.26 R56.1
CSENSE: length 4
  Top Layer w0.508: R59.1 R60.2 25.27,46.11 C66.2
DC_CAL: length 32.2
  Top Layer w0.254: v2(40.9,20.57) 40.9,19.1 U7.8
  Bottom Layer w0.254: v2(40.9,20.57) 41.4,20.08 41.4,11.18 41.91,10.67 46.1,10.67 46.61,10.16 46.61,8.26 46.86,8 51.43,8 52.07,7.37 52.07,5.84 52.32,5.59 53.21,5.59 53.72,5.08 53.72,2.41 54.48,1.65 H5.13
EN_GATE: length 32.5
  Top Layer w0.254: U7.12 42.89,19.99 42.8,20.08 v2(42.8,20.45)
  Bottom Layer w0.254: H5.15 56.26,2.92 56.26,5.59 55.88,5.97 53.34,5.97 52.96,6.35 52.96,7.87 52.2,8.64 47.63,8.64 47.24,9.02 47.24,10.67 46.74,11.18 43.31,11.18 42.8,11.68 v2(42.8,20.45)
ENC_A: length 38.6
  Top Layer w0.254: H4.5 83.18,22.35 82.55,21.72 82.55,19.18 82.04,18.67 69.47,18.67 68.45,17.65 68.45,9.65 68.07,9.27 63.75,9.27 63.5,9.02 63.5,5.08 H5.20
ENC_B: length 42.9
  Top Layer w0.254: H4.4 82.17,24.89 81.53,24.26 81.53,20.19 80.9,19.56 68.83,19.56 67.82,18.54 67.82,10.54 67.44,10.16 63.25,10.16 62.74,9.65 62.74,6.73 62.36,6.35 61.47,6.35 61.09,5.97 61.09,5.21 H5.18
ENC_I: length 48.8
  Top Layer w0.254: H4.3 81.28,27.43 80.64,26.8 80.64,20.96 80.14,20.45 67.44,20.45 66.93,19.94 66.93,11.43 66.42,10.92 62.61,10.92 61.85,10.16 61.85,7.75 61.47,7.37 57.79,7.37 57.53,7.11 H5.16
GH_A: length 19.8
  Top Layer w0.254: U7.43 39.89,24.4 39.75,24.26 38.48,24.26 38.1,24.64 36.96,24.64 36.58,25.02 36.58,27.81 36.45,27.94 35.81,27.94 35.43,28.32 35.43,37.14 R48.1
GH_B: length 43.5
  Top Layer w0.254: v1(53.34,40.01) 55.38,40.01 R54.1 ; U7.38 42.4,26.67 v2(42.4,25.4) ; v1(53.34,35.69) v1(58.88,35.69)
  Bottom Layer w0.254: v1(58.88,35.69) 58.88,24.98 57.91,24 47.37,24 46.48,23.11 42.67,23.11 42.42,23.37 42.42,25.38 v2(42.4,25.4) ; v1(53.34,35.69) v1(53.34,40.01)
GH_C: length 46.5
  Top Layer w0.254: v1(15.37,42.67) 15.37,44.14 R61.1 ; U7.33 44.89,28.01 v2(44.58,28.32)
  Bottom Layer w0.254: v1(15.37,42.67) 16.13,43.43 23.37,43.43 23.88,42.93 23.88,40.64 24.64,39.88 30.86,39.88 31.37,39.37 31.37,29.97 31.75,29.59 44.2,29.59 44.58,29.21 v2(44.58,28.32)
GL_A: length 19.5
  Top Layer w0.254: R49.1 41.36,34.12 41.15,33.91 36.58,33.91 36.32,33.66 36.32,31.12 36.7,30.73 40.26,30.73 40.64,30.35 40.64,28.32 40.89,28.07 40.89,26.69 U7.41
GL_B: length 35
  Top Layer w0.254: R55.1 61.22,39.85 v1(60.05,39.85) ; v2(43.43,25.15) 43.39,25.19 U7.36
  Bottom Layer w0.254: v1(60.05,39.85) 60.02,39.88 56.77,39.88 56.26,39.37 56.26,26.8 55.63,26.16 47.24,26.16 46.86,25.78 46.86,24.38 46.48,24 44.07,24 44.07,24.51 v2(43.43,25.15)
GL_C: length 45.8
  Top Layer w0.254: U7.31 45.89,25.78 45.85,25.74 v1(45.85,25.4) ; v1(19.94,42.8) 19.43,42.8 19.25,42.98 R62.1
  Bottom Layer w0.254: v1(45.85,25.4) 44.96,25.4 44.7,25.65 44.7,27.31 44.07,27.94 20.45,27.94 19.94,28.45 v1(19.94,42.8)
INH_A: length 31.4
  Top Layer w0.254: U7.13 43.43,19.04 v2(43.43,17.65)
  Bottom Layer w0.254: v2(43.43,17.65) 43.43,12.19 43.69,11.94 47.24,11.94 47.88,11.3 47.88,9.53 48.26,9.14 52.96,9.14 53.59,8.51 53.59,6.86 53.98,6.48 56.64,6.48 57.02,6.1 57.02,5.72 57.4,5.33 58.55,5.33 58.8,5.08 58.8,2.92 H5.17
INH_B: length 30
  Top Layer w0.254: H5.2 38.86,5.08 34.42,5.08 33.91,5.59 33.91,14.35 34.42,14.86 44.14,14.86 44.39,15.11 U7.15
INH_C: length 33.3
  Top Layer w0.254: 44.32,4.19 H5.6 43.56,5.46 43.05,5.46 43.05,6.22 42.8,6.48 35.94,6.48 35.31,7.11 35.31,13.33 35.69,13.72 45.01,13.72 45.39,14.1 U7.17
INL_A: length 36
  Top Layer w0.254: U7.14 43.9,19.09 v2(43.9,20.45)
  Bottom Layer w0.254: v2(43.9,20.45) 43.94,20.45 44.32,20.07 44.32,12.95 44.83,12.45 48.13,12.45 48.51,12.07 48.51,10.16 48.89,9.78 53.98,9.78 54.36,9.4 54.36,7.49 54.74,7.11 57.15,7.11 57.53,6.73 57.53,6.22 57.91,5.84 60.96,5.84 61.47,5.33 61.47,2.88 62.61,1.73 H5.19
INL_B: length 31.2
  Top Layer w0.254: H5.4 40.64,5.84 35.05,5.84 34.67,6.22 34.67,13.97 35.04,14.34 44.64,14.34 44.89,14.59 U7.16
INL_C: length 35.3
  Top Layer w0.254: H5.8 47.37,6.73 46.86,7.24 36.32,7.24 35.94,7.62 35.94,12.57 36.45,13.08 45.59,13.08 45.85,13.34 45.85,19.04 U7.18
NFAULT: length 33.9
  Top Layer w0.254: R43.1 32.99,22.73 33.24,22.48 37.59,22.48 37.89,22.18 U7.2 37.89,18.08 v1(37.59,17.78)
  Bottom Layer w0.254: v1(37.59,17.78) 36.7,17.78 35.94,17.02 35.94,7.62 36.32,7.24 40.64,7.24 41.02,6.86 41.02,2.92 H5.3
NOCTW: length 40.4
  Top Layer w0.254: R42.1 32.14,26.43 31.88,26.16 31.88,22.48 32.39,21.97 36.96,21.97 37.39,21.54 U7.1 36.47,18.16 33.91,18.16 33.02,17.27 33.02,2.29 33.65,1.65 H5.1
NSCS: length 29
  Top Layer w0.254: v2(38.99,20.57) 38.99,20.08 38.89,19.99 U7.4
  Bottom Layer w0.254: v2(38.99,20.57) 38.48,20.07 38.48,17.4 38.23,17.15 37.46,17.15 36.7,16.38 36.7,8.13 36.96,7.87 43.18,7.87 43.43,7.62 43.43,2.79 44.58,1.65 H5.5
REF: length 37
  Top Layer w0.254: H5.10 49.91,7.49 49.53,7.87 36.96,7.87 36.7,8.13 36.7,12.07 37.21,12.57 45.85,12.57 46.36,13.08 46.36,17.4 46.89,17.94 U7.20
SCLK: length 31.1
  Top Layer w0.254: U7.7 40.39,17.9 v2(40.51,17.78)
  Bottom Layer w0.254: 51.94,2.16 H5.11 52.2,1.65 51.18,2.67 51.18,6.73 50.8,7.11 45.72,7.11 45.47,7.37 45.47,9.78 45.21,10.03 39.37,10.03 39.12,10.29 39.12,15.37 39.24,15.49 39.75,15.49 40.51,16.26 v2(40.51,17.78)
SDI: length 26.3
  Top Layer w0.254: v2(39.12,17.78) 39.39,18.06 U7.5
  Bottom Layer w0.254: H5.7 46.1,2.92 46.1,5.72 45.85,5.97 44.45,5.97 44.07,6.35 44.07,8.64 43.69,9.02 38.35,9.02 37.85,9.53 37.85,16.13 38.23,16.51 38.73,16.51 39.12,16.89 v2(39.12,17.78)
SDO: length 31.1
  Top Layer w0.254: U7.6 39.88,19.1 v2(39.88,20.57)
  Bottom Layer w0.254: v2(39.88,20.57) 39.88,16.76 39.12,16 38.61,16 38.48,15.88 38.48,9.91 38.86,9.53 44.32,9.53 44.83,9.02 44.83,6.73 45.08,6.48 48.26,6.48 48.64,6.1 48.64,2.92 H5.9
SH_A: length 129
  Top Layer w0.254: R50.2 42.67,43.51 42.67,44.7 ; v1(42.67,45.97) 42.67,44.7 ; 42.67,44.7 42.67,44.71 Q1.5 ; v1(40.39,23.62) 40.39,23.63 U7.42 40.32,26.75 40.32,28.01 39.3,29.03 C54.1 ; v1(30.35,24.26) 30.35,26.16 30.23,26.29 30.23,31.37 30.99,32.13 33.91,32.13 34.16,32.39 34.16,40.89 34.67,41.4 36.15,41.4 Q1.1 36.16,42.13 36.45,42.42 39.24,42.42 39.37,42.55 39.37,44.71 ; v1(48.39,50.42) 48.77,50.8 53.34,50.8 53.85,51.31 53.85,54.56 54.1,54.82 56.43,54.82 57.66,53.59
  Bottom Layer w0.254: v1(30.35,24.26) 30.35,23.88 30.61,23.62 v1(40.39,23.62) ; 57.66,53.59 57.66,51.31 58.29,50.67 65.79,50.67 66.42,50.04 66.42,19.18 66.8,18.8 75.57,18.8 75.88,18.48 U5.7 ; v1(48.39,50.42) 43.94,50.42 43.18,49.66 43.18,46.48 v1(42.67,45.97)
SH_B: length 109
  Top Layer w0.254: R56.2 59.75,46.16 ; 59.75,46.16 59.75,50.36 59.44,50.67 55.37,50.67 55.12,50.93 55.12,53.59 ; 59.75,46.16 Q3.5 59.69,46.1 59.69,43.94 59.56,43.82 56.64,43.82 56.49,43.66 Q3.1 56.36,42.93 v1(54.99,42.93) ; v1(42.42,34.67) 42.42,33.78 42.16,33.53 41.15,33.53 40.89,33.27 40.64,33.27 C55.1 41.51,32.54 41.66,32.39 41.66,28.74 42.89,27.5 U7.37
  Bottom Layer w0.254: v1(42.42,34.67) 52.2,34.67 52.7,35.18 52.7,42.42 53.21,42.93 v1(54.99,42.93) ; 71.68,15.83 66.46,15.83 65.79,16.51 65.79,49.28 64.9,50.17 55.63,50.17 55.12,50.67 55.12,53.59
SH_C: length 133.3
  Top Layer w0.254: 46.86,51.56 52.32,51.56 52.58,51.82 52.58,53.59 ; 46.86,51.56 46.86,34.54 46.36,34.04 43.69,34.04 43.18,33.53 43.18,31.62 43.56,31.24 44.7,31.24 45.08,30.86 45.08,29.8 C56.1 45.14,28.9 45.39,28.65 U7.32 ; 46.86,51.56 42.8,51.56 42.42,51.18 42.42,49.91 42.16,49.66 23.88,49.66 ; 23.88,49.66 R59.2 ; 23.88,49.66 20.29,49.66 Q2.5 20.07,49.7 20.07,48.77 18.8,47.5 17.27,47.5 16.95,47.18 Q2.1
  Bottom Layer w0.254: 71.68,10.33 66.25,10.33 65.02,11.56 65.02,48.77 64.14,49.66 53.09,49.66 52.58,50.17 52.58,53.59
SL_A: length 30.7
  Top Layer w0.254: 42.46,32.64 42.46,31.34 v1(42.41,31.29) ; v2(41.4,25.4) 41.4,26.67 U7.40 ; v1(33.4,31.24) 31.24,31.24 30.86,30.86 v1(30.86,26.54)
  Bottom Layer w0.254: v1(33.4,31.24) 42.36,31.24 v1(42.41,31.29) ; v1(30.86,26.54) 31.24,26.92 41.02,26.92 41.4,26.54 v2(41.4,25.4)
SL_B: length 28.2
  Top Layer w0.254: R64.1 51.61,42.67 51.69,42.67 51.69,26.54 51.31,26.16 50.42,26.16 49.28,25.02 49.28,24.51 48.77,24 46.23,24 45.72,24.51 45.72,24.77 45.47,25.02 44.39,25.02 43.89,25.51 U7.35
SL_C: length 35.4
  Top Layer w0.254: U7.30 46.36,26.72 v1(46.36,28.32) ; R63.1 25.39,40.65 v1(25.4,40.64)
  Bottom Layer w0.254: v1(46.36,28.32) 46.36,29.85 45.97,30.23 32.77,30.23 32.13,30.86 32.13,39.88 31.37,40.64 v1(25.4,40.64)
SN1: length 28.4
  Top Layer w0.254: v1(45.21,31.88) 45.21,32.68 45.23,32.69 ; U7.29 46.89,30.45 46.5,30.84 R47.2 45.23,32.69 ; R65.2 44.02,32.69 45.23,32.69 ; Q1.3 38.73,41.36 38.73,40.26 39.01,39.99 C59.2 38.82,38.74 v1(37.34,38.74)
  Bottom Layer w0.254: v1(37.34,38.74) 37.34,32.26 37.72,31.88 v1(45.21,31.88)
SN2: length 40
  Top Layer w0.254: R64.2 52.48,41.63 52.58,41.53 56.01,41.53 56.26,41.28 56.26,39.12 56.52,38.86 56.77,38.86 57.02,38.61 57.02,38.24 R53.2 ; R53.2 56.89,36.84 v1(57.02,36.7) ; R53.2 58.99,38.1 C62.2 59.05,42.77 Q3.3 ; v1(47.88,24.64) 47.89,24.65 U7.27
  Bottom Layer w0.254: v1(57.02,36.7) 57.02,26.04 55.63,24.64 v1(47.88,24.64)
SO1: length 15.5
  Top Layer w0.254: 52.45,4.83 H5.12 51.82,4.83 51.82,12.7 51.43,13.08 50.04,13.08 49.78,13.34 49.78,16.13 49.66,16.26 48.87,16.26 R45.2
SO2: length 30.1
  Top Layer w0.254: H5.14 54.99,3.56 54.48,3.05 51.43,3.05 51.18,3.3 51.18,8.38 50.8,8.76 45.72,8.76 ; C51.2 41.35,9.07 41.66,8.76 45.72,8.76 ; 45.72,8.76 45.72,10.57 C50.2 45.9,10.54 48.13,10.54 48.85,11.26 R46.2
SP1: length 4.2
  Top Layer w0.254: R52.1 47.61,29.71 47.37,29.46 47.37,26.7 U7.28
SP2: length 23.6
  Top Layer w0.254: U7.26 48.39,26.69 48.39,28.19 48.64,28.45 50.93,28.45 51.18,28.7 51.18,42.04 50.93,42.29 49.91,42.29 49.66,42.55 49.66,45.09 50.03,45.46 R58.1
$3N286: length 2.4
  Top Layer w0.254: LED1.1 75.33,24.61 R10.1
$3N603: length 27.6
  Top Layer w0.254: CN2.2 10.75,13.13 11.3,12.57 11.3,5.72 11.68,5.33 23.88,5.33 23.92,5.38 ; SW1.2 23.92,5.38 ; 23.92,5.38 SW1.1
$3N605: length 3.5
  Top Layer w0.254: R41.1 13.6,13.93 LED2.1
$3N1469: length 13.9
  Top Layer w0.254: U7.3 38.35,19.12 38.35,23.75 38.1,24 36.32,24 35.97,24.36 35.97,26.77 35.31,27.43 33.15,27.43 32.99,27.59 R44.1
$3N1546: length 5
  Top Layer w0.254: C48.2 39.24,16.08 39.24,17.02 39.37,17.15 41.15,17.15 41.4,17.4 41.4,19.07 U7.9
$3N1634: length 3.3
  Top Layer w0.254: C49.1 41.59,16.95 41.91,17.27 41.91,19.07 U7.10
$3N1637: length 3.6
  Top Layer w0.254: C49.2 42.99,16.83 42.8,17.02 42.55,17.02 42.39,17.17 U7.11
$3N1642: length 2.9
  Top Layer w0.254: U7.21 47.39,16.28 R45.1
$3N1645: length 5
  Top Layer w0.254: R46.1 48.13,15.27 48.13,17.02 47.89,17.26 47.88,19.07 U7.22
$3N1837: length 8.2
  Top Layer w0.254: U7.23 48.39,19.08 48.39,17.55 48.54,17.4 50.08,17.4 50.42,17.06 50.42,14.71 50.67,14.46 C52.1
$3N1907: length 10.1
  Top Layer w0.254: U7.19 46.39,20.1 46.61,20.32 52.07,20.32 52.43,19.96 C53.1
$3N2117: length 4.4
  Top Layer w0.254: U7.44 39.39,27.5 38.96,27.94 37.72,27.94 37.3,28.36 C54.2
$3N2227: length 3.8
  Top Layer w0.254: C56.2 43.14,28.49 43.31,28.32 43.69,28.32 44.39,27.62 U7.34
$3N2233: length 9.1
  Top Layer w0.254: U7.39 41.89,27.83 41.15,28.58 41.15,30.99 40.89,31.24 38.1,31.24 37.9,31.44 C55.2
$4N615: length 3.3
  Top Layer w0.254: Q1.2 37.43,40.23 37.21,40.01 36.2,40.01 36.03,39.84 R48.2
$4N618: length 3.6
  Top Layer w0.254: Q1.4 39.97,40.42 40.13,40.26 41.15,40.26 41.4,40.01 41.4,39.03 R49.2
$4N1413: length 3.1
  Top Layer w0.254: R54.2 57.02,40.14 57.02,41.15 57.28,41.4 57.53,41.4 57.76,41.63 Q3.2
$4N1415: length 5
  Top Layer w0.254: Q3.4 60.33,42.77 60.33,41.66 60.58,41.4 62.48,41.4 62.82,41.07 R55.2
$4N1749: length 3.5
  Top Layer w0.254: R61.2 16.82,44.88 17.02,45.09 18.09,45.09 18.22,45.21 Q2.2
$4N1755: length 2.2
  Top Layer w0.254: Q2.4 20.76,44.26 R62.2
$4N2179: length 11
  Top Layer w0.254: C68.1 26.42,36.07 26.16,36.32 21.46,36.32 21.21,36.58 21.21,39.12 21.09,39.24 R68.2

## Copper pours and planes (outline as drawn; the poured copper is in the pictures)
AGND on Top Layer: 0,58.17 87.12,58.17 87.12,-0.51 0,-0.51
AGND on Bottom Layer: -1.02,58.8 87.5,58.8 87.5,-1.52 -1.02,-1.52

Small or netless copper shapes (teardrops, artwork), in the pictures only: 340 on Top Layer, 90 on Bottom Layer
